# Altium schematic sheet Power and Crystal.SchDoc
size A; SheetNumber: 3; SheetTotal: 4
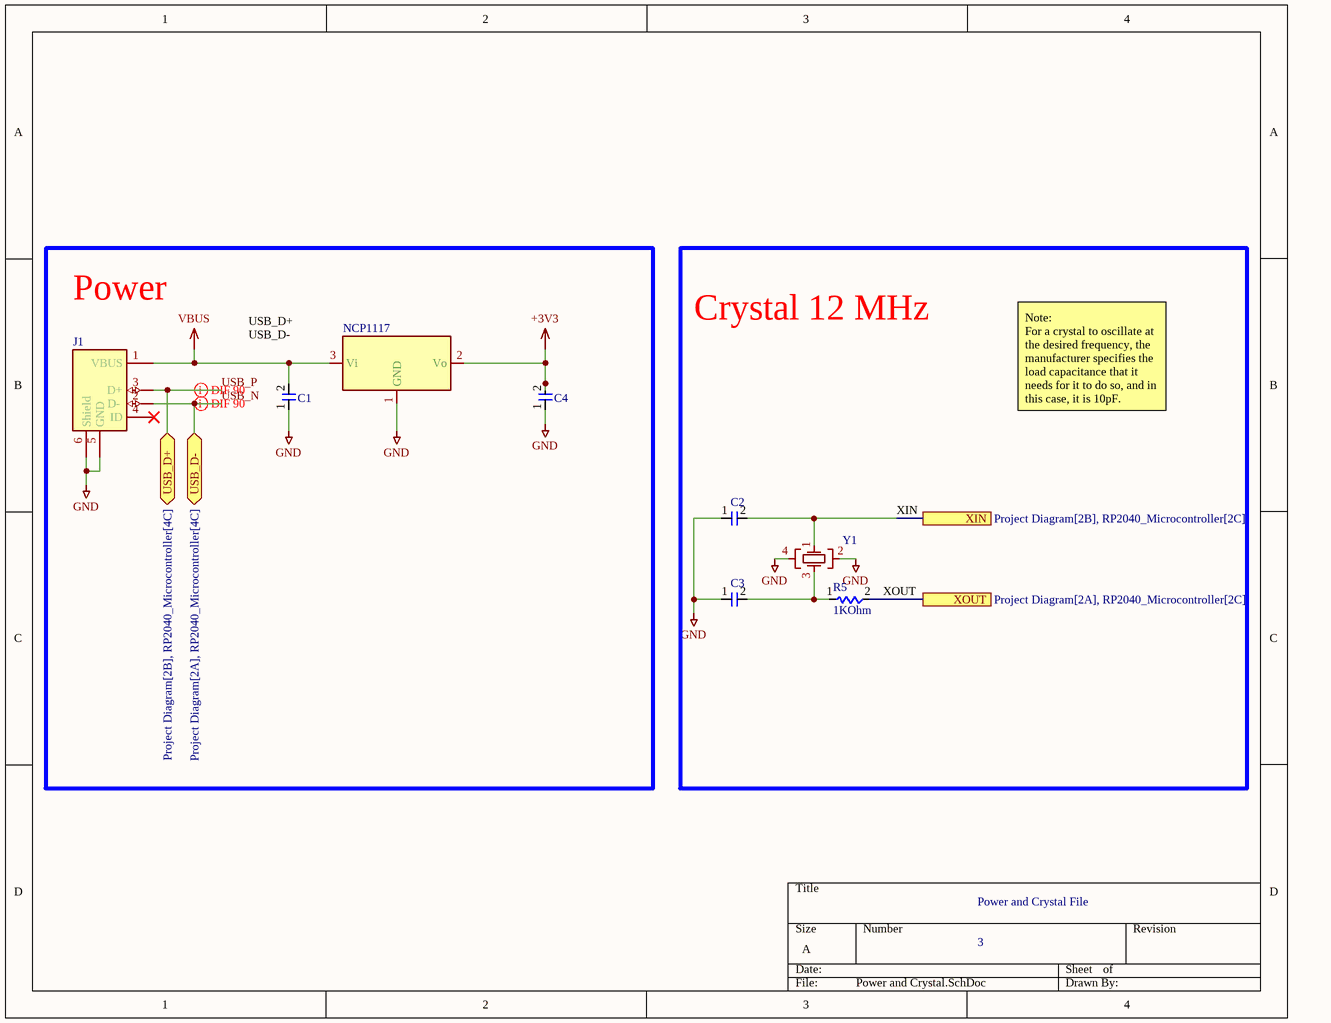
[diagram p0: Power and Crystal.SchDoc]

## Parts
C1  10UF Capacitor  [CL21A106KOQNNNE - duplicate]  (value not drawn)
C2  CAP CER 15PF 50V  [CAP CER 15PF 50V]  (value not drawn)
C3  CAP CER 15PF 50V  [CAP CER 15PF 50V]  (value not drawn)
C4  10UF Capacitor  [CL21A106KOQNNNE - duplicate]  (value not drawn)
J1  USB_B Micro  [USB_B Micro]  (value not drawn)
NCP1117  IC REG LINEAR 3.3V 1A SOT223  [NCP1117LPST33T3G]  (value not drawn)
R5  1KOhm  [RC1206FR-078K06L]
Y1  Crystal 12 MHz  [Crystal 12 MHz]  (value not drawn)

## Blocks framed on the sheet
Power: C1 C4 J1 NCP1117
Crystal 12 MHz: C2 C3 R5 Y1

## Ports
USB_D+ (bidir, see Project Diagram[2B], RP2040_Microcontroller[4C]), USB_D- (bidir, see Project Diagram[2A], RP2040_Microcontroller[4C]), XIN (see Project Diagram[2B], RP2040_Microcontroller[2C]), XOUT (see Project Diagram[2A], RP2040_Microcontroller[2C])

## Nets
+3V3: C4.2(Pin_2) NCP1117.2(Vo)
GND: C1.1(Pin_1) C2.1(Pin_1) C3.1(Pin_1) C4.1(Pin_1) J1.5(GND) J1.6(Shield) NCP1117.1(GND) Y1.2 Y1.4
VBUS: C1.2(Pin_2) J1.1(VBUS) NCP1117.3(Vi)
USB_N: J1.2(D-) ; port USB_D-
USB_P: J1.3(D+) ; port USB_D+
XIN: C2.2(Pin_2) Y1.1 ; port XIN
XOUT: R5.2(pin_2) ; port XOUT
NetC3_2: C3.2(Pin_2) R5.1(Pin_1) Y1.3

Not connected (* = marked no-connect by the designer): J1 4(ID)*

## Layout directives
differential pair; differential pair class DIF 90; net class DIF 90: USB_N, USB_P

## Notes on the sheet
- Note:
  For a crystal to oscillate at the desired frequency, the manufacturer specifies the load capacitance that it needs for it to do so, and in this case, it is 10pF.
- Power and Crystal File
- Labels drawn without touching a wire or pin: USB_D+, USB_D-

## Library data of the parts
C1 C4 = CL21A106KOQNNNE: 10 µF ±10% 16V Ceramic Capacitor X5R 0805 (2012 Metric); Part Number: CL21A106KOQNNNE; Link: https://www.digikey.com/en/products/detail/samsung-electro-mechanics/CL21A106KOQNNNE/3886754; Value: 10UF
C2 C3 = CAP CER 15PF 50V: 15 pF ±5% 50V Ceramic Capacitor C0G, NP0 0805 (2012 Metric); Part Number: CC0805JRNPO9BN150; Link: https://www.digikey.com/en/products/detail/yageo/CC0805JRNPO9BN150/302835
J1 = USB_B Micro: Conn Data USB Micro B w/Flange SMT Bottom Mnt LF | Molex Incorporated 47346-0001; Part Number: 47346-0001; Link: https://www.snapeda.com/parts/47346-0001/Molex/view-part/
NCP1117 = NCP1117LPST33T3G: Linear Voltage Regulator IC Positive Fixed 1 Output 1A SOT-223; Part Number: NCP1117LPST33T3GOSTR-ND; Link: https://www.digikey.com/en/products/detail/onsemi/NCP1117LPST33T3G/2194024
R5 = RC1206FR-078K06L: 8.06 kOhms ±1% 0.25W, 1/4W Chip Resistor 1206 (3216 Metric) Moisture Resistant Thick Film; Part Number: RC1206FR-078K06L; Link: https://www.digikey.com/en/products/detail/yageo/RC1206FR-078K06L/729108
Y1 = Crystal 12 MHz: 12 MHz ±30ppm Crystal 18pF 150 Ohms 4-SMD, No Lead; Part Number: 403C35D12M00000; Link: https://www.digikey.com/en/products/detail/cts-frequency-controls/403C35D12M00000/2292747